# Altium schematic sheet Buck_Converter.SchDoc
size A4; SheetNumber: 1; SheetTotal: 1
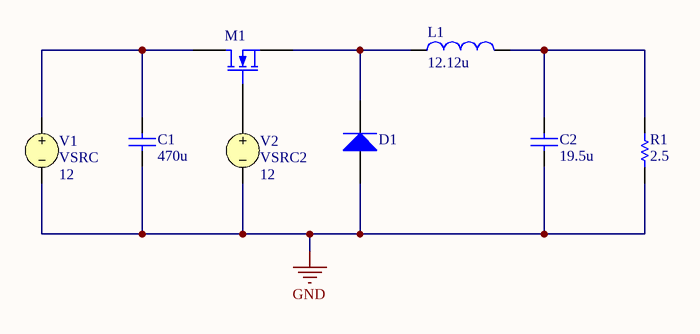
[diagram p0: Buck_Converter.SchDoc]

## Parts
C1  value 470u  (hidden comment: Capacitor)
C2  value 19.5u  (hidden comment: Capacitor)
D1  Diode  (value not drawn)
L1  value 12.12u  (hidden comment: Inductor)
M1  N-chanel Power MOSFET VDMOS Model  (value not drawn)
R1  value 2.5  (hidden comment: Resistor)
V1  VSRC  value 12
V2  VSRC2  DC Magnitude: 12

## Nets
GND: C1.1 C2.1 D1.1(A) R1.1 V1.2 V2.2
NetC1_2: C1.2 M1.1(D) V1.1
NetC2_2: C2.2 L1.2 R1.2
NetD1_2: D1.2(K) L1.1 M1.3(S)
NetM1_2: M1.2(G) V2.1

## Library data of the parts
C1 C2 = Capacitor: SimulationGenericComponent: True
D1 = Diode: AF: 1; BV: 0; BV_MAX: 1e99; EG: 1.11; FC: 0.5; IBV: 0.001; ISR: 1e-14; MJSW: 0.33; NTUN: 30; TNOM: 27; XTI: 3; SimulationGenericComponent: True; CJO: 0; CJP: 0; CTA: 0; CTP: 0; FCS: 0.5; FV_MAX: 1e99; IKF: 0; IKR: 0; JSW: 0; JTUN: 0; JTUNSW: 0; KEG: 1; KF: 0; LEVEL: 1; N: 1; NBV: 1; NR: 1; NS: 1; PHP: 1; RS: 0; TCV: 0; TLEV: 0; TLEVC: 0; TM1: 0; TM2: 0; TPB: 0; TPHP: 0; TRS: 0; TRS2: 0; TT: 0; TTT1: 0; TTT2: 0; VJ: 1; XTITUN: 3; IS: 1e-14
L1 = Inductor: SimulationGenericComponent: True
M1 = MOSFET P-ch VDMOS: XTI: 0; A: 1; BV: 1e30; EG: 1.11; FC: 0.5; IBV: 1e-10; IS: 1e-14; PHI: 0.6; TNOM: 27; VJ: 0.8; SimulationGenericComponent: True; CGDMAX: 0; CGDMIN: 0; CGS: 0; CJO: 0; KP: 1; KSUBTHRES: 0; LAMBDA: 0; M: 0.5; MTRIODE: 1; N: 1; NBV: 1; NCHAN: 1; PCHAN: 1; RB: 0; RD: 0; RDS: 1e30; RG: 0; RQ: 0; RS: 0; SUBSHIFT: 0; SUBSLOPE: 0; THETA: 0; TT: 0; VQ: 0; VTO: 0
R1 = Resistor: TC1: 0; SimulationGenericComponent: True; TC2: 0
V1 = VSRC: Voltage Source; Note: PCB Footprint - Not required; AC Magnitude: 1; AC Phase: 0; Published: 8-Jun-2000; LatestRevisionDate: 17-Jul-2002; LatestRevisionNote: Re-released for DXP Platform.; PackageReference: Not Applicable; Publisher: Altium Limited
V2 = VSRC: Voltage Source; Note: PCB Footprint - Not required; AC Magnitude: 1; AC Phase: 0; Rise Time: 10n; Pulse Width: 1.04u; Period: 2.5u; Published: 8-Jun-2000; LatestRevisionDate: 17-Jul-2002; LatestRevisionNote: Re-released for DXP Platform.; PackageReference: Not Applicable; Publisher: Altium Limited; Initial Value: 0; Pulsed Value: 12; Time Delay: 0; Fall Time: 10n; Phase: 0